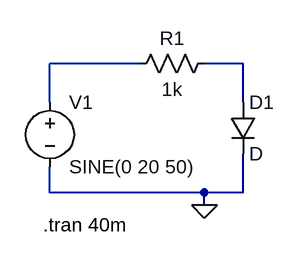
[diagram p0: schematic HalfWaveRectifier.asc]
HalfWaveRectifier.asc, the LTspice schematic file:
Version 4
SHEET 1 880 680
WIRE 224 176 112 176
WIRE 352 176 304 176
WIRE 112 224 112 176
WIRE 352 224 352 176
WIRE 112 336 112 304
WIRE 304 336 112 336
WIRE 352 336 352 288
WIRE 352 336 304 336
WIRE 304 352 304 336
FLAG 304 352 0
SYMBOL voltage 112 208 R0
SYMATTR InstName V1
SYMATTR Value SINE(0 20 50)
SYMBOL res 320 160 R90
WINDOW 0 0 56 VBottom 2
WINDOW 3 32 56 VTop 2
SYMATTR InstName R1
SYMATTR Value 1k
SYMBOL diode 336 224 R0
SYMATTR InstName D1
TEXT 104 376 Left 2 !.tran 40m

The netlist it stands for:
* HalfWaveRectifier.asc
V1 N001 0 SINE(0 20 50)
R1 N002 N001 1k
D1 N002 0 D
.model D D
.lib standard.dio
.tran 40m
.backanno
.end